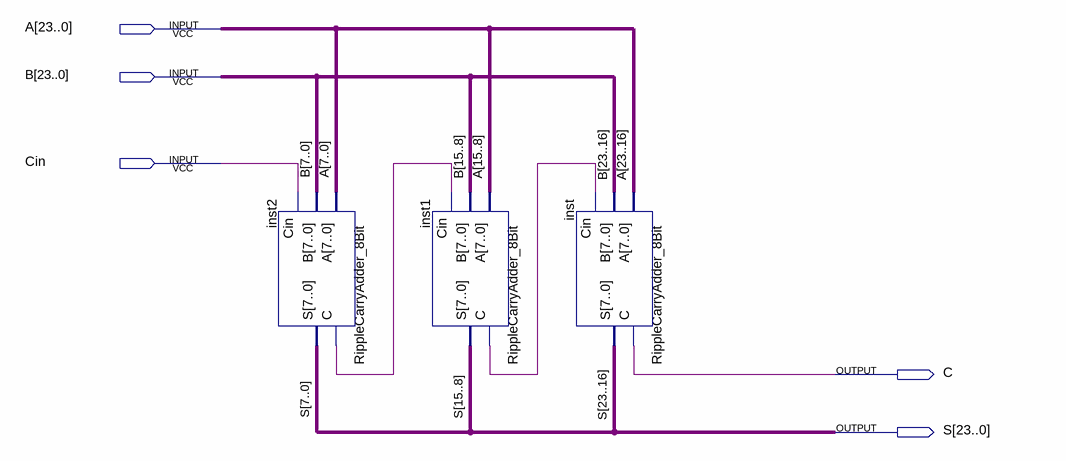
[diagram p0: schematic sheet]
// Quartus schematic RippleCarryAdder_24Bit.bdf as structural Verilog: 3 symbols, 5 pins
module RippleCarryAdder_24Bit (
  input  [23:0] A,
  input  [23:0] B,
  input  Cin,
  output C,
  output [23:0] S
);

  wire inst1_c, inst2_c;

  RippleCarryAdder_8Bit inst2 (.A(A[7:0]), .B(B[7:0]), .Cin(Cin), .C(inst2_c), .S(S[7:0]));
  RippleCarryAdder_8Bit inst1 (.A(A[15:8]), .B(B[15:8]), .Cin(inst2_c), .C(inst1_c), .S(S[15:8]));
  RippleCarryAdder_8Bit inst (.A(A[23:16]), .B(B[23:16]), .Cin(inst1_c), .C(C), .S(S[23:16]));
endmodule
